# EAGLE design PWMled (EAGLE 9.0.0)
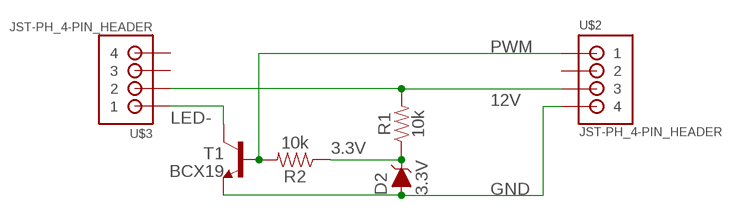
[diagram p0: schematic, sheet 1]

## Parts
D2  3.3V  DIODE-ZENER-MM3Z3V3T1G  [SOD-323]
R1  10k  10KOHM-0603-1/10W-1%  [0603]
R2  10k  10KOHM-0603-1/10W-1%  [0603]
T1  BCX19  [SOT23]
U$2  JST-PH_4-PIN_HEADER  [JST_B4B-PH_HEADER]
U$3  JST-PH_4-PIN_HEADER  [JST_B4B-PH_HEADER]

## Nets
3.3V: D2.C R1.1 R2.1
12V: R1.2 U$2.P3 U$3.P2
GND: D2.A T1.2(E) U$2.P4
LED-: T1.3(C) U$3.P1
PWM: R2.2 T1.1(B) U$2.P1
Unconnected: U$2.P2 U$3.P3 U$3.P4

## Library data of the parts
D2 = SparkFun-DiscreteSemi:DIODE-ZENER: Zener Diode A Zener diode allows current to flow from its anode to its cathode like a normal semiconductor diode, but it also permits current to flow in the reverse direction when its "Zener voltage" is reached. - WIkipedia; PROD_ID: DIO-11284
R1 R2 = SparkFun-Resistors:10KOHM: 10kΩ resistor A resistor is a passive two-terminal electrical component that implements electrical resistance as a circuit element. Resistors act to reduce current flow, and, at the same time, act to lower voltage levels within circuits. - Wikipedia; PROD_ID: RES-00824
T1 = NXP_60_26022015:BCX19: NPN general purpose transistor NPN transistor in a SOT23 plastic package. PNP complement: BCX17. AAL Eindhoven MK
U$2 U$3 = SRG:JST-PH_4-PIN_HEADER: 4-pin JST PH Shrouded Header, top entry P/N B4B-PH-K-S Mating connector PHR-4 Mating cable assembly: Sparkfun PRT-09916 <http://www.sparkfun.com/products/9916>

## Board
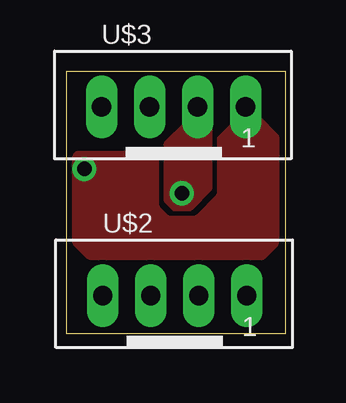
[diagram p1: board, top side]
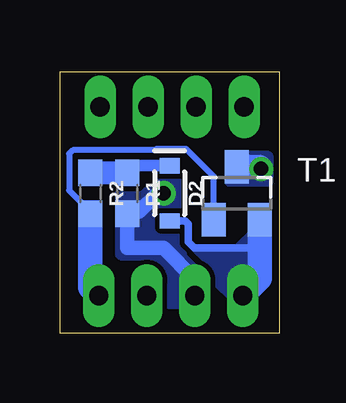
[diagram p2: board, bottom side, seen from below]

Size 9.14 x 10.92 mm. Coordinates in mm from the lower left corner, seen from the top.
Outline: 0,10.92 0,0 9.14,0 9.14,10.92 0,10.92
Copper layers (1*16): Top 0.035mm / dielectric 1.5mm / Bottom 0.035mm
Design rules "default *": minimum track width 10mil, minimum drill 24mil, track to track 8mil, track to pad 8mil, pad to pad 8mil, via to via 8mil, smd to smd 8mil, copper to edge 0mil, drill to drill 8mil, minimum pad ring 10mil, minimum via ring 8mil, stop-mask expansion 4mil, vias tented up to drill 24mil, thermal gap 10mil

### Footprints (pad centres in the part's own frame; a part is rotated, then mirrored left to right if it is on the bottom)
SOD-323 = smd 0.63 x 0.83: A 1.15,0; C -1.15,0
0603 = smd 1.1 x 1: 1 -0.85,0; 2 0.85,0
SOT23 = smd 1 x 1.4: 1 -0.95,-1.1; 2 0.95,-1.1; 3 0,1.1
JST_B4B-PH_HEADER = drill 0.8 long: P1 2.98,0.048; P2 0.98,0.048; P3 -1.02,0.048; P4 -3.02,0.048

### Placement (x,y rotation side)
D2  4.57,5.84 270 bottom
R1  6.35,5.84 270 bottom
R2  7.87,5.84 270 bottom
T1  1.78,5.84 0 bottom
U$2  4.55,1.52 0 top
U$3  4.5,9.4 0 top

### Tracks (layer width: path | path; a pad name or v marks a point on that pad's centre or on a via)
3.3V
  Bottom 0.305: 6.05,6.99 R1.1
  Bottom 0.483: D2.C 6.05,6.99
  Bottom 0.965: R1.1 R2.1
12V  (via drill 0.6)
  Top 1.016: U$3.P2 5.59,9.45
  Bottom 0.61: v4.83,5.84 5.08,5.84 5.84,5.08 6.26,5.08 R1.2 6.35,3.56 4.83,3.56 3.53,2.26 U$2.P3
  pour Bottom (rank 2, no thermals): 3.56,1.27 3.56,3.3 4.32,4.06 5.08,4.06 5.08,5.08 4.32,5.08 4.32,6.35 4.83,6.35 5.33,5.84 6.6,5.84 6.6,3.3 5.44,3.3 arc45 5.26,3.23 5.08,3.05 4.57,2.54 4.57,1.27
  pour Top (no thermals): 5.84,6.6 5.84,6.1 5.08,5.33 4.57,5.33 4.32,5.59 4.32,7.87 5.08,8.64 5.84,8.64
GND
  Bottom 0.305: 1.52,2.29 1.51,2.29 1.17,1.95 | D2.A 3.93,4.69 3.81,4.57 3.81,3.81 3.56,3.56 0.83,3.56
  Bottom 1.016: T1.2 0.83,3.56 0.83,2.3 1.05,2.07 1.17,1.95 U$2.P4
  pour Bottom (no thermals): 1.52,1.52 2.03,1.52 2.54,2.03 2.54,2.54 3.56,3.56 1.78,3.56 1.02,4.32 1.02,2.03
LED-  (via drill 0.6)
  Top 1.016: 7.62,9.3 U$3.P1
  Bottom 1.016: T1.3 0.85,6.94 v0.76,6.86
  pour Bottom (isolate 0.305, rank 3, no thermals): 1.52,7.37 0.51,7.37 0.51,6.35 2.03,6.35 2.03,7.37
  pour Top (rank 2, no thermals): 0.51,7.37 5.84,7.37 7.37,8.89 7.87,8.89 8.64,8.13 8.64,4.32 8.64,3.92 arc-45 8.56,3.74 8.13,3.3 1.27,3.3 1.12,3.3 arc-45 0.94,3.38 0.51,3.81
PWM
  Bottom 0.254: T1.1 2.73,6.54 3.89,7.7 5.13,7.7 5.18,7.64 8.61,7.64 8.76,7.49 8.76,5.97 8.13,5.33 | 8.13,5.33 8.13,5.25 | R2.2 7.87,5.08 8.13,5.33
  Bottom 1.016: U$2.P1 7.87,1.92 R2.2